# EAGLE design xbeeschema (EAGLE 5.11)
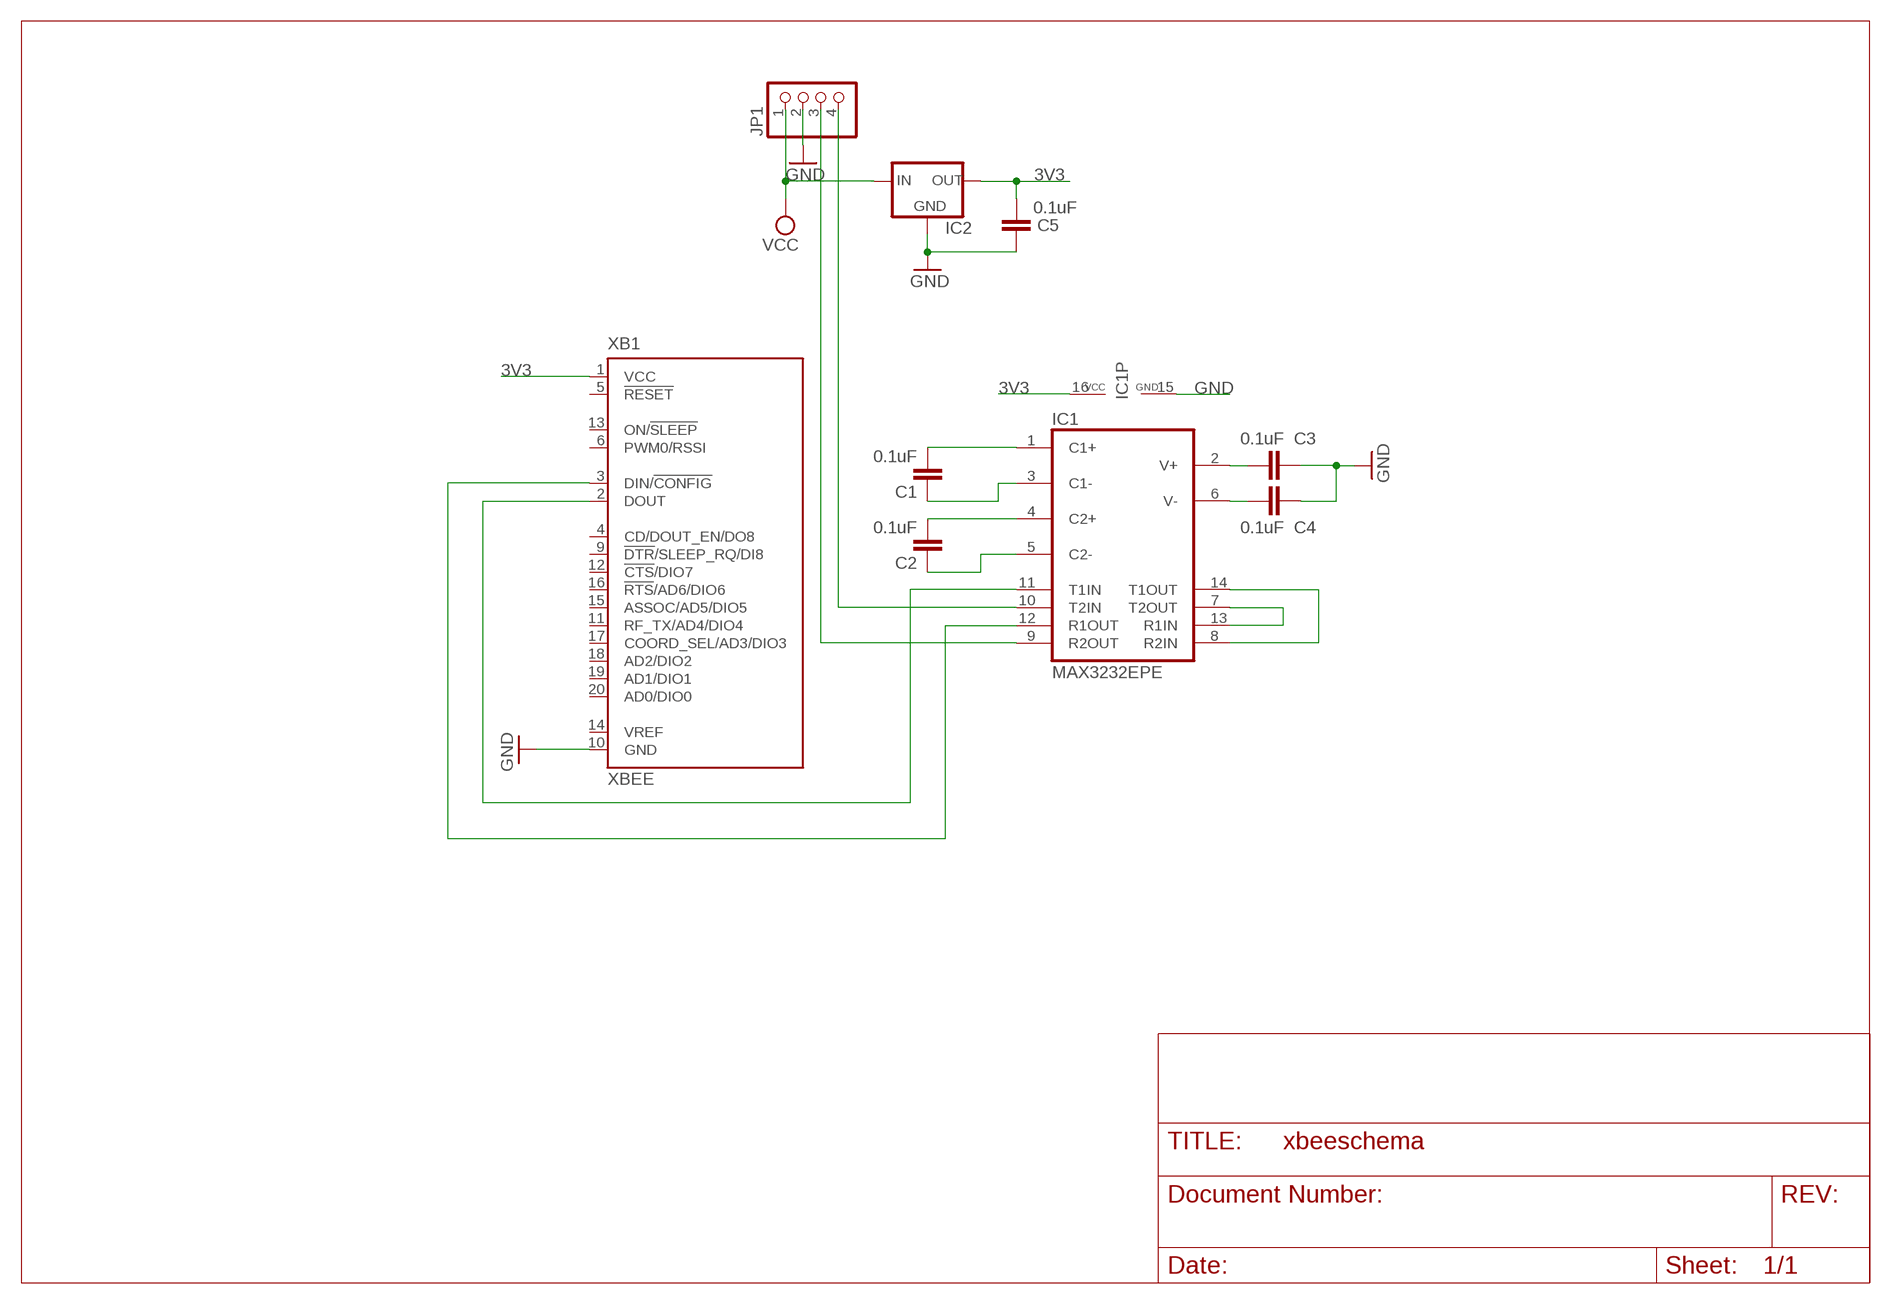
[diagram p0: schematic, sheet 1]

## Parts
C1  0.1uF  C2,5-3  [C2.5-3]
C2  0.1uF  C2,5-3  [C2.5-3]
C3  0.1uF  C2,5-3  [C2.5-3]
C4  0.1uF  C2,5-3  [C2.5-3]
C5  0.1uF  C2,5-3  [C2.5-3]
IC1  MAX3232EPE  [DIL16]
IC2  LM1117  [SOT223]
JP1  PINHD-1X4  [1X04]
XB1  XBEE  [XBEE]

## Nets
3V3: C5.2 IC1.16(VCC) IC2.2(OUT) XB1.1(VCC)
GND: C3.1 C4.1 C5.1 IC1.15(GND) IC2.1(GND) JP1.2 XB1.10(GND)
N$1: IC1.7(T2OUT) IC1.13(R1IN)
N$2: C1.2 IC1.1(C1+)
N$3: C1.1 IC1.3(C1-)
N$4: C2.2 IC1.4(C2+)
N$5: C2.1 IC1.5(C2-)
N$6: C3.2 IC1.2(V+)
N$7: C4.2 IC1.6(V-)
N$8: IC1.8(R2IN) IC1.14(T1OUT)
N$9: IC1.9(R2OUT) JP1.3
N$10: IC1.10(T2IN) JP1.4
N$11: IC1.12(R1OUT) XB1.3(DIN/!CONFIG)
N$12: IC1.11(T1IN) XB1.2(DOUT)
VCC: IC2.3(IN) JP1.1
Unconnected: XB1.4(CD/DOUT_EN/DO8) XB1.5(!RESET) XB1.6(PWM0/RSSI) XB1.9(!DTR!/SLEEP_RQ/DI8) XB1.11(RF_TX/AD4/DIO4) XB1.12(!CTS!/DIO7) XB1.13(ON/!SLEEP) XB1.14(VREF) XB1.15(ASSOC/AD5/DIO5) XB1.16(!RTS!/AD6/DIO6) XB1.17(COORD_SEL/AD3/DIO3) XB1.18(AD2/DIO2) XB1.19(AD1/DIO1) XB1.20(AD0/DIO0)

## Library data of the parts
C1-C5 = capacitor-wima:C: CAPACITOR naming: grid - package width
IC1 = maxim:MAX3232*: True RS-232 Transceivers 3.0V to 5.5V, Low-Power up to 1Mbps, Using Four 0.1µF External Capacitors Source: http://pdfserv.maxim-ic.com/en/ds/MAX3222-MAX3241.pdf; MPN: MAX3232EPE+; OC_FARNELL: unknown; OC_NEWARK: 67K4860
IC2 = v-reg-2:LM1117
JP1 = pinhead:PINHD-1X4: PIN HEADER
XB1 = maxstream:XBEE: XBee (TM) /XBee-PRO(TM) OEM RF Modules Source: MaxStream, Inc. xbee_productmanual.pdf; MPN: XBP24-Z7UIT-004; OC_FARNELL: 1751799; OC_NEWARK: 34R5507

## Board
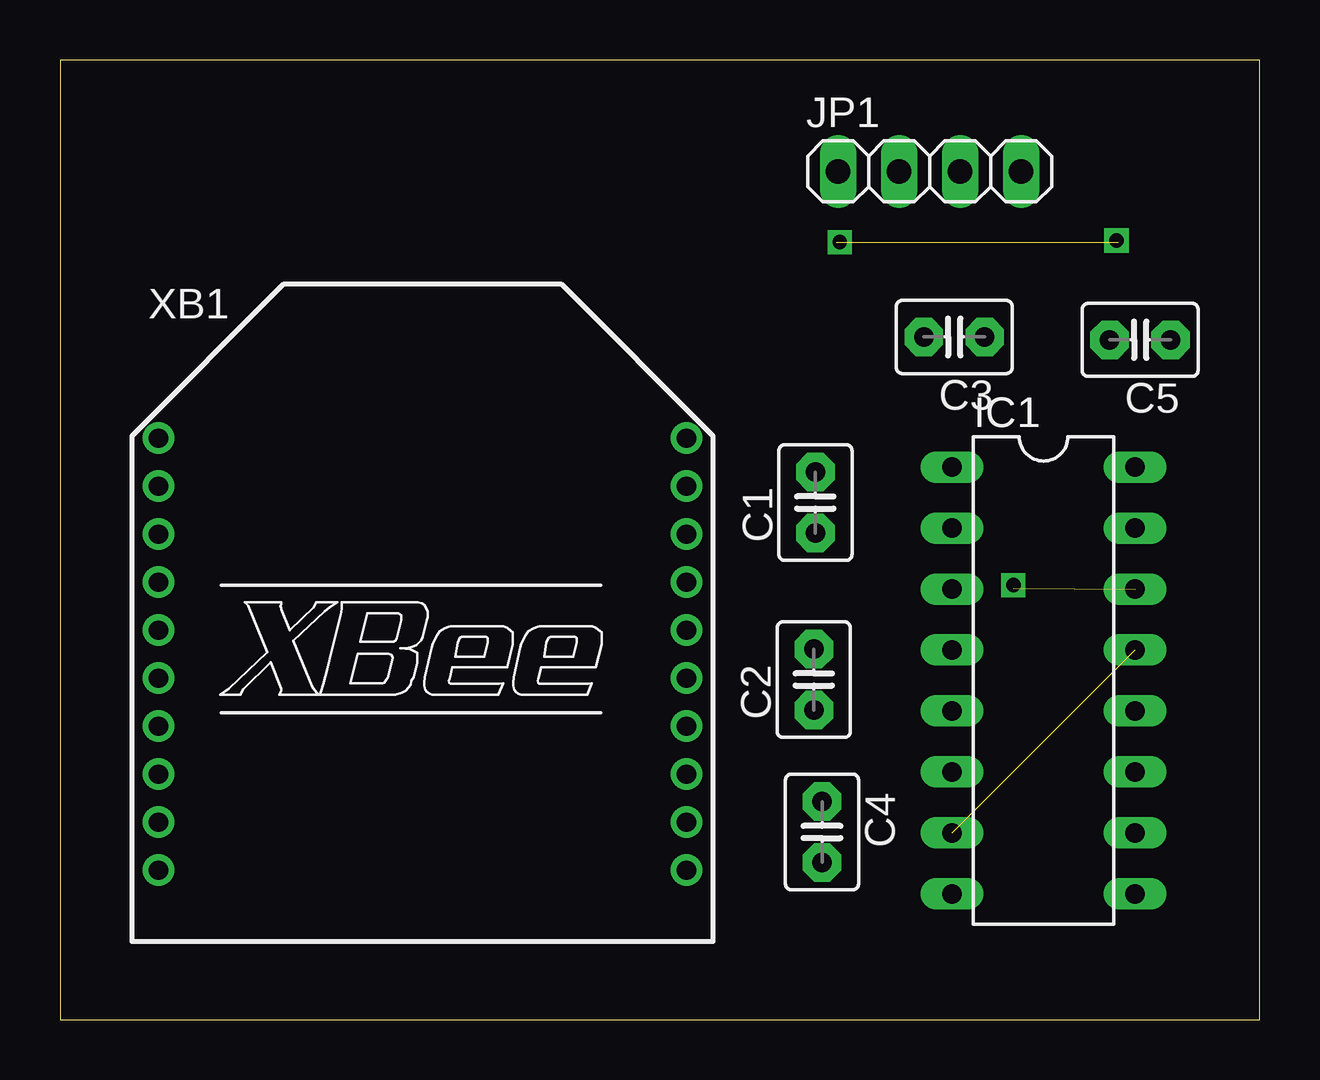
[diagram p1: board, top side]
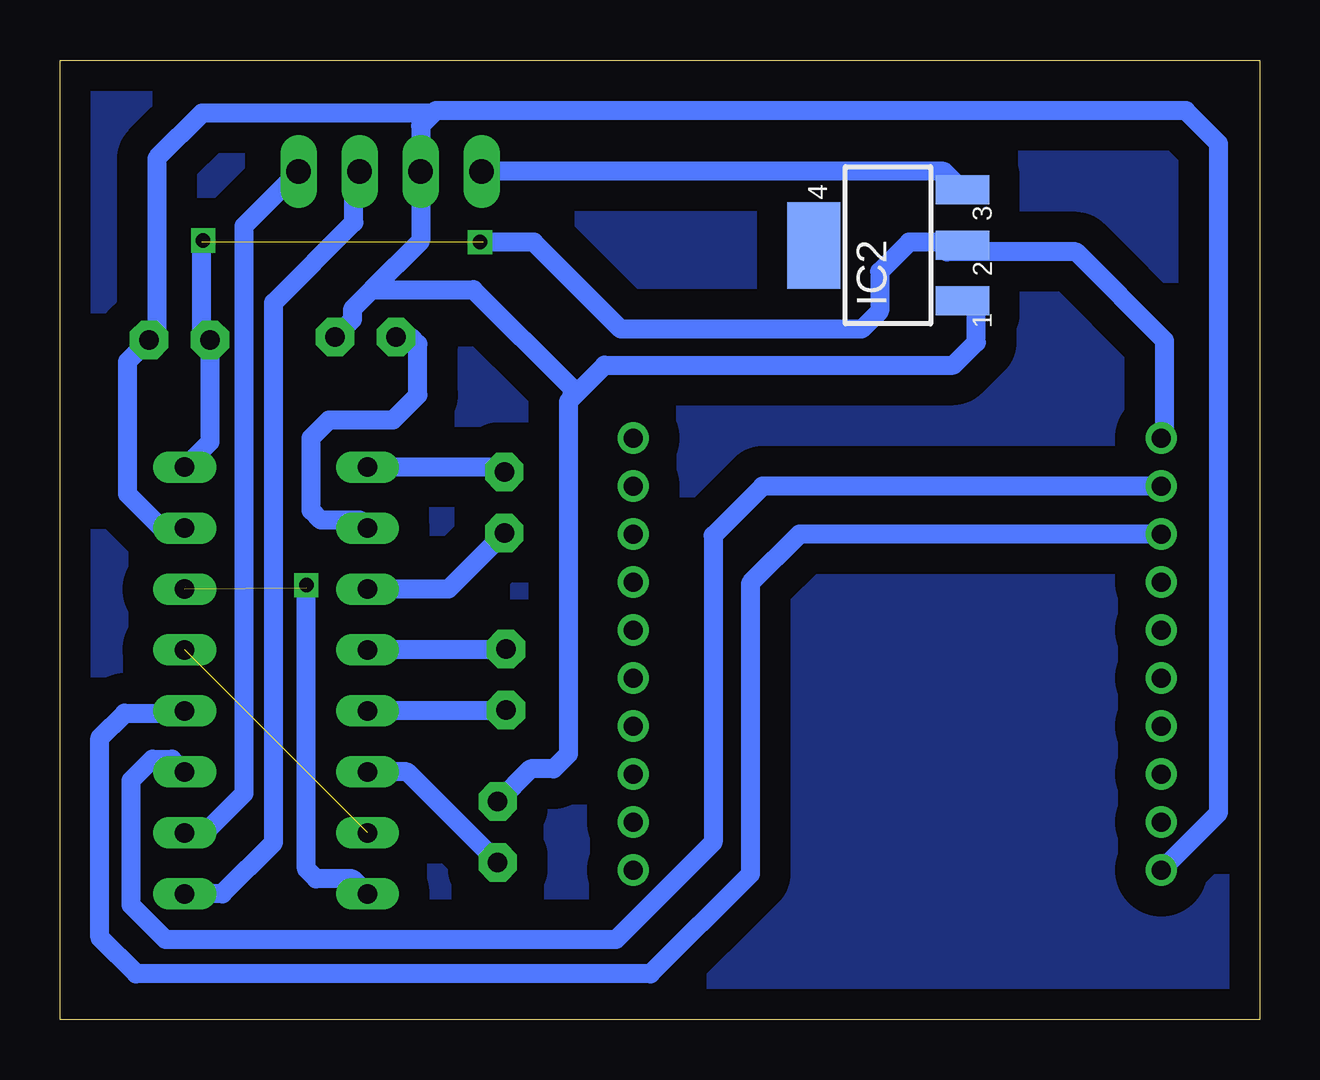
[diagram p2: board, bottom side, seen from below]

Size 49.99 x 40 mm. Coordinates in mm from the lower left corner, seen from the top.
Outline: 0,0 49.99,0 49.99,40 0,40 0,0
Copper layers (1*16): Top 0.035mm / dielectric 1.5mm / Bottom 0.035mm
Design rules "default *": minimum track width 0.8mm, minimum drill 24mil, track to track 8mil, track to pad 8mil, pad to pad 8mil, via to via 8mil, smd to smd 8mil, copper to edge 40mil, drill to drill 8mil, minimum pad ring 10mil, minimum via ring 8mil, stop-mask expansion 4mil, vias tented up to drill 0mil, thermal gap 10mil

### Footprints (pad centres in the part's own frame; a part is rotated, then mirrored left to right if it is on the bottom)
C2.5-3 = drill 0.813 pad 1.6 octagon: 1 -1.27,0; 2 1.27,0
DIL16 = drill 0.813 long: 1 -8.89,-3.81; 2 -6.35,-3.81; 3 -3.81,-3.81; 4 -1.27,-3.81; 5 1.27,-3.81; 6 3.81,-3.81; 7 6.35,-3.81; 8 8.89,-3.81; 9 8.89,3.81; 10 6.35,3.81; 11 3.81,3.81; 12 1.27,3.81; 13 -1.27,3.81; 14 -3.81,3.81; 15 -6.35,3.81; 16 -8.89,3.81
SOT223 = smd 1.219 x 2.235: 1 -2.311,-3.099; 2 0,-3.099; 3 2.311,-3.099 | smd 3.6 x 2.2: 4 0,3.099
1X04 = drill 1.016 long: 1 -3.81,0; 2 -1.27,0; 3 1.27,0; 4 3.81,0
XBEE = drill 0.8 pad 1.27 round: 1 -11,9; 2 -11,7; 3 -11,5; 4 -11,3; 5 -11,1; 6 -11,-1; 7 -11,-3; 8 -11,-5; 9 -11,-7; 10 -11,-9; 11 11,-9; 12 11,-7; 13 11,-5; 14 11,-3; 15 11,-1; 16 11,1; 17 11,3; 18 11,5; 19 11,7; 20 11,9

### Placement (x,y rotation side)
C1  31.48,21.56 90 top
C2  31.41,14.18 90 top
C3  37.26,28.46 180 top
C4  31.75,7.83 270 top
C5  45.01,28.34 180 top
IC1  40.98,14.14 270 top
IC2  15.49,32.28 90 bottom
JP1  36.23,35.35 0 top
XB1  15.1,15.24 0 top

### Tracks (layer width: path | path; a pad name or v marks a point on that pad's centre or on a via)
3V3  (1 unrouted)
  Bottom 0.8: IC1.16 43.74,24.09 C5.2 44.09,28.69 44.09,32.41 | XB1.1 3.96,24.39 3.96,28.31 7.65,32 13.04,32 12.76,32.28 IC2.2 12.52,32.41 14.61,32.41 15.84,31.18 15.84,29.54 16.59,28.79 26.62,28.79 30.24,32.41 32.35,32.41
GND
  Bottom 0.8: XB1.10 1.71,8.63 1.71,36.51 3.08,37.88 34.33,37.88 34.43,37.78 | 34.43,37.78 34.97,37.25 JP1.2 34.97,32.45 36.99,30.43 | IC1.15 45.76,20.49 47.19,21.92 47.19,27.43 C5.1 45.95,28.66 45.95,35.9 44.07,37.78 34.43,37.78 | C4.1 30.39,10.46 29.42,10.46 28.8,11.07 28.8,25.78 28.67,25.91 | 28.67,25.91 27.3,27.28 12.76,27.28 11.81,28.24 11.81,29.88 11.89,29.96 IC2.1 | C3.1 37.81,29.18 37.81,29.61 36.99,30.43 | 36.99,30.43 32.76,30.43 28.67,26.33 28.67,25.91
N$1  (1 unrouted)
N$2
  Bottom 0.8: C1.2 31.68,23.03 IC1.1
N$3
  Bottom 0.8: C1.1 33.81,17.95 IC1.3
N$4
  Bottom 0.8: C2.2 31.45,15.41 IC1.4
N$5
  Bottom 0.8: C2.1 31.45,12.87 IC1.5
N$6
  Bottom 0.8: IC1.2 37.5,20.83 39.12,20.83 39.53,21.24 39.53,24.25 38.77,25 36.11,25 35.08,26.03 35.08,28.16 35.38,28.46 C3.2
N$7
  Bottom 0.8: C4.2 35.52,10.33 IC1.6
N$8  (1 unrouted)
  Bottom 0.8: IC1.8 37.8,5.88 39.31,5.88 39.72,6.29 39.72,17.98
N$9
  Bottom 0.8: JP1.3 37.74,35.12 37.74,33.23 41.09,29.89 41.09,7.38 43.22,5.25 IC1.9
N$10
  Bottom 0.8: JP1.4 42.32,33.08 42.32,9.44 43.96,7.79 IC1.10
N$11
  Bottom 0.8: IC1.12 44.88,12.79 47.3,12.79 48.32,11.76 48.32,3.42 46.82,1.92 25.39,1.92 21.23,6.08 21.23,18.19 19.17,20.24 XB1.3
N$12
  Bottom 0.8: IC1.11 45.33,10.87 46.14,10.87 47.03,9.98 47.03,4.79 45.59,3.35 26.82,3.35 22.77,7.4 22.77,20.18 20.71,22.24 XB1.2
N$13  (via drill 0.6)
  other vias: 32.49,32.41
N$14  (via drill 0.6)
  other vias: 44.02,32.48
N$15  (via drill 0.6)
  other vias: 39.72,18.12
N$16
  pour Bottom (isolate 1.27): 0.21,0.28 0.55,0.62 0.55,39.54 0.83,39.26 49.27,39.26 49.34,39.19 49.34,0.48 0.48,0.48
VCC
  Bottom 0.8: IC2.3 13.15,35.35 JP1.1